# EAGLE design Cortex_ST-Link_Adapter (EAGLE 7.6.0)
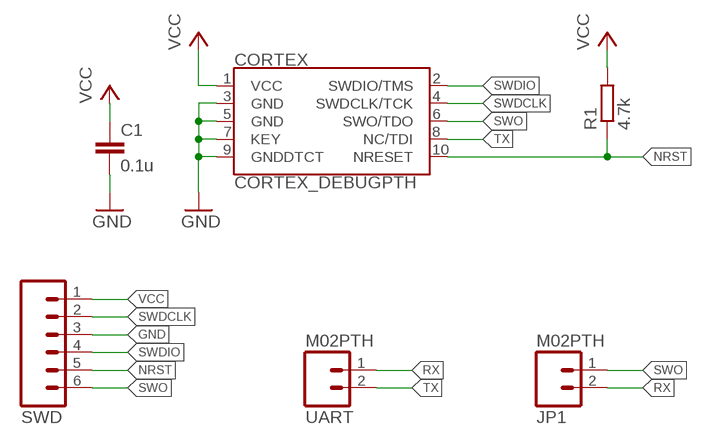
[diagram p0: schematic, sheet 1]

## Parts
C1  0.1u  C-EUC0805  [C0805]
CORTEX  CORTEX_DEBUGPTH  [2X5-PTH-1.27MM]
JP1  M02PTH  [1X02]
R1  4.7k  R-EU_R0805  [R0805]
SWD  M06SILK_FEMALE_PTH  [1X06]
UART  M02PTH  [1X02]

## Nets
GND: C1.2 CORTEX.3(GND) CORTEX.5(GND) CORTEX.7(KEY) CORTEX.9(GNDDTCT) SWD.3
NRST: CORTEX.10(NRESET) R1.1 SWD.5
RX: JP1.2 UART.1
SWDCLK: CORTEX.4(SWDCLK/TCK) SWD.2
SWDIO: CORTEX.2(SWDIO/TMS) SWD.4
SWO: CORTEX.6(SWO/TDO) JP1.1 SWD.6
TX: CORTEX.8(NC/TDI) UART.2
VCC: C1.1 CORTEX.1(VCC) R1.2 SWD.1

## Library data of the parts
C1 = rcl:C-EU: CAPACITOR, European symbol
CORTEX = LibreSolar:CORTEX_DEBUG: Cortex Debug Connector Datasheet <http://infocenter.arm.com/help/topic/com.arm.doc.faqs/attached/13634/cortex_debug_connectors.pdf>
JP1 UART = SparkFun-Connectors:M02: Standard 2-pin 0.1" header. Use with - straight break away headers ( PRT-00116) - right angle break away headers (PRT-00553) - swiss pins (PRT-00743) - machine pins (PRT-00117) - female headers (PRT-00115) Molex polarized connector foot print use with: PRT-08233 with associated crimp pins and housings. 2.54_SCREWTERM for use with PRT-10571. 3.5mm Screw Terminal footprints for PRT-08084 5mm Screw Terminal footprints for use with PRT-08432
R1 = rcl:R-EU_: RESISTOR, European symbol
SWD = SparkFun-Connectors:M06: Header 6 Standard 6-pin 0.1" header. Use with straight break away headers (SKU : PRT-00116), right angle break away headers (PRT-00553), swiss pins (PRT-00743), machine pins (PRT-00117), and female headers (PRT-00115). Molex polarized connector foot print use with SKU : PRT-08094 with associated crimp pins and housings. NOTES ON THE VARIANTS LOCK and LOCK_LONGPADS... This footprint was designed to help hold the alignment of a through-hole component (i.e. 6-pin header) while soldering it into place. You may notice that each hole has been shifted either up or down by 0.005 of an inch from it's more standard position (which is a perfectly straight line). This slight alteration caused the pins (the squares in the middle) to touch the edges of the holes. Because they are alternating, it causes a "brace" to hold the component in place. 0.005 has proven to be the perfect amount of "off-center" position when using our standard breakaway headers. Although looks a little odd when you look at the bare footprint, once you have a header in there, the alteration is very hard to notice. Also,if you push a header all the way into place, it is covered up entirely on the bottom side. This idea of altering the position of holes to aid alignment will be further integrated into the Sparkfun Library for other footprints. It can help hold any component with 3 or more connection pins.; PROD_ID: CONN-08437

## Net classes
0 default: width 0.203 mm, drill 0.5 mm, clearance 0.152 mm

## Board
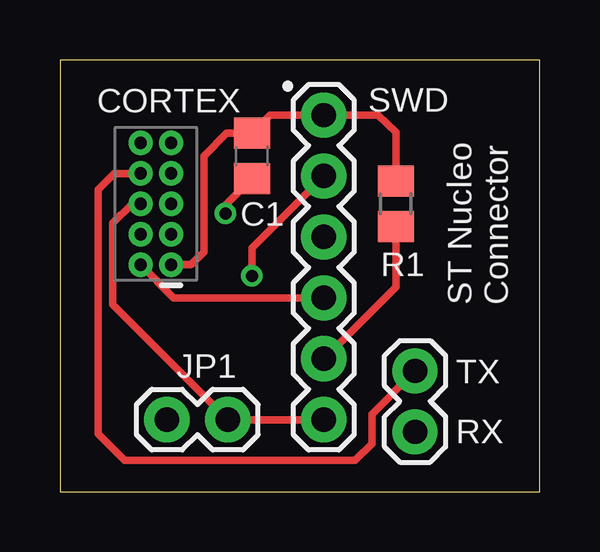
[diagram p1: board, top side]
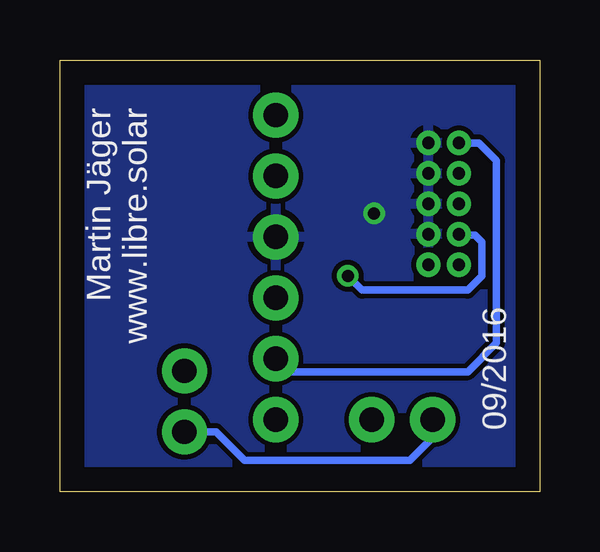
[diagram p2: board, bottom side, seen from below]

Size 20 x 18 mm. Coordinates in mm from the lower left corner, seen from the top.
Outline: 0,0 20,0 20,18 0,18 0,0
Copper layers (1*16): Top 0.035mm / dielectric 1.5mm / Bottom 0.035mm
Design rules "default": minimum track width 10mil, minimum drill 24mil, track to track 8mil, track to pad 8mil, pad to pad 8mil, via to via 8mil, smd to smd 8mil, copper to edge 40mil, drill to drill 8mil, minimum pad ring 10mil, minimum via ring 8mil, stop-mask expansion 4mil, vias tented up to drill 0mil, thermal gap 10mil

### Footprints (pad centres in the part's own frame; a part is rotated, then mirrored left to right if it is on the bottom)
C0805 = smd 1.3 x 1.5: 1 -0.95,0; 2 0.95,0
2X5-PTH-1.27MM = drill 0.508 pad 1: 1 -2.54,-0.635; 2 -2.54,0.635; 3 -1.27,-0.635; 4 -1.27,0.635; 5 0,-0.635; 6 0,0.635; 7 1.27,-0.635; 8 1.27,0.635; 9 2.54,-0.635; 10 2.54,0.635
1X02 = drill 1.016 pad 1.88: 1 0,0; 2 2.54,0
R0805 = smd 1.3 x 1.5: 1 -0.95,0; 2 0.95,0
1X06 = drill 1.016 pad 1.88: 1 0,0; 2 2.54,0; 3 5.08,0; 4 7.62,0; 5 10.16,0; 6 12.7,0

### Placement (x,y rotation side)
C1  8,14 270 top
CORTEX  4,12 90 top
JP1  7,3 180 top
R1  14,12 90 top
SWD  11,15.7 270 top
UART  14.81,2.49 90 top

### Tracks (layer width: path | path; a pad name or v marks a point on that pad's centre or on a via)
GND  (via drill 0.5)
  Top 0.305: v6.9,11.6 6.9,11.95 C1.2
  pour Bottom: -2,20 22,20 22,-2 -2,-2
NRST
  Top 0.305: SWD.5 14,8.54 R1.1
  Bottom 0.305: SWD.5 10.46,5 3,5 1.8,6.2 1.8,13.8 2.54,14.54 CORTEX.10
RX
  Bottom 0.305: UART.1 13.49,2.49 12.3,1.3 5.4,1.3 4.46,2.24 JP1.2
SWDCLK  (via drill 0.5)
  Top 0.305: v8,9 8,10.16 SWD.2
  Bottom 0.305: CORTEX.4 3.33,10.7 2.7,10.7 2.4,10.4 2.4,9 3,8.4 7.4,8.4 v8,9
SWDIO
  Top 0.305: CORTEX.2 4.75,8.08 SWD.4
SWO
  Top 0.305: CORTEX.6 3,12 2.2,11.2 2.2,7.8 JP1.1 SWD.6
TX
  Top 0.305: UART.2 13,3.22 13,2 12.3,1.3 2.7,1.3 1.6,2.4 1.6,12.6 2.27,13.27 CORTEX.8
VCC
  Top 0.305: R1.2 14,15 13.25,15.7 SWD.1 8.75,15.7 C1.1 6.95,14.95 6,14 6,10 5.46,9.46 CORTEX.1

### Text on the board
tPlace: ST Nucleo / Connector | TX | RX
bPlace: Martin Jäger / www.libre.solar | 09/2016